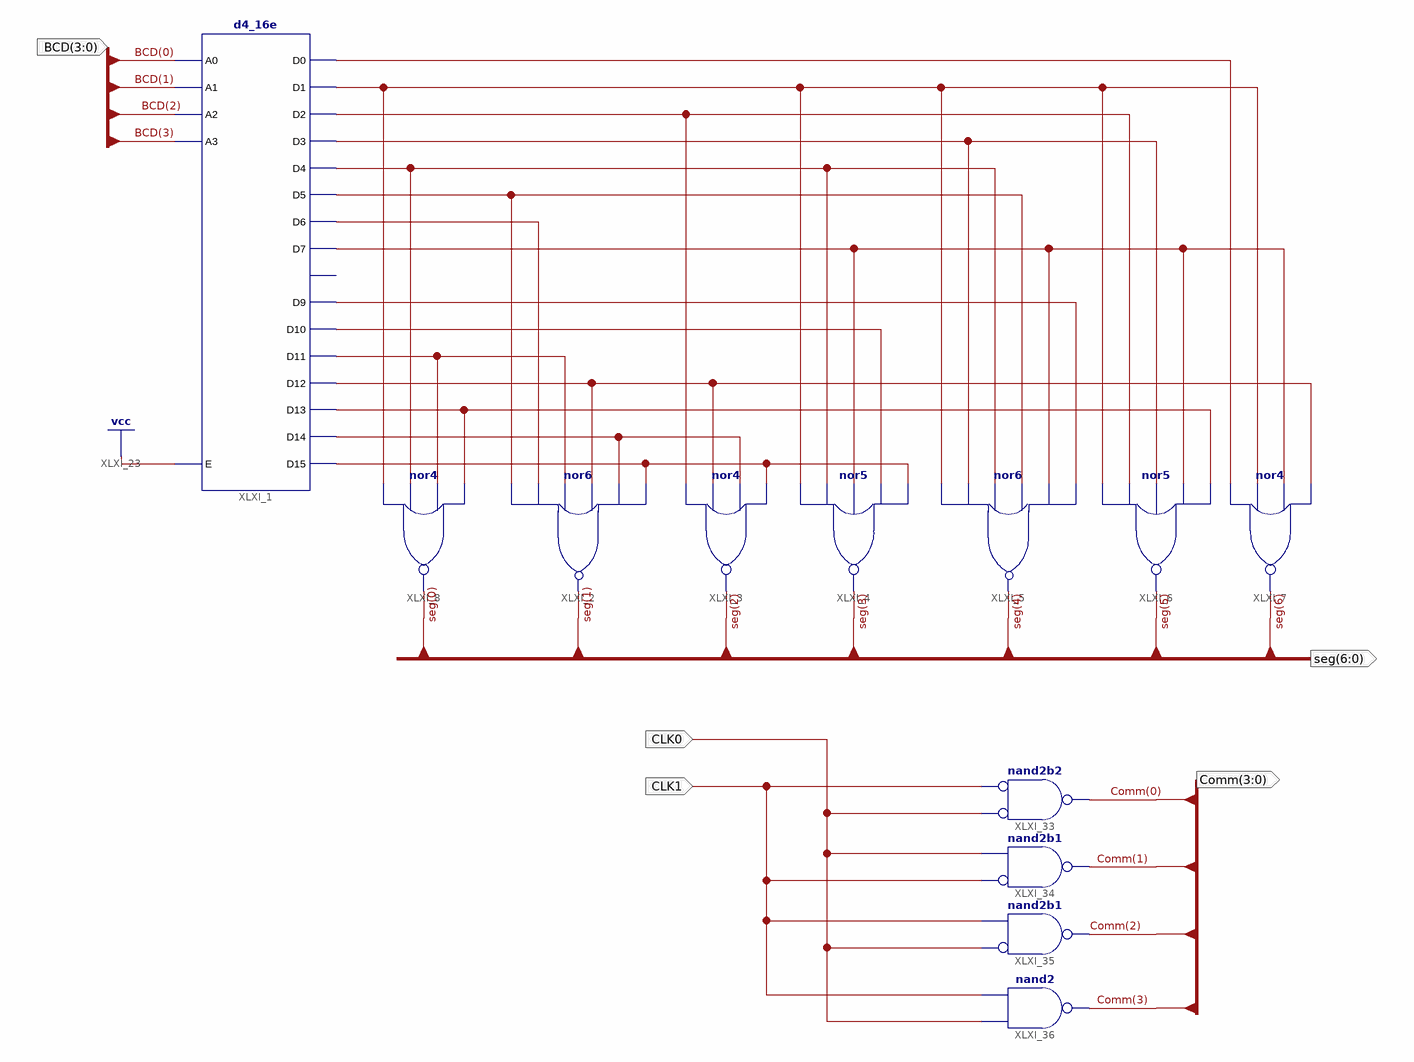
[diagram p0: schematic sheet 1]
// Xilinx ISE schematic Hexto7seg.sch (spartan6) as structural Verilog: 12 symbols, 5 ports
module Hexto7seg (
  input  [3:0] BCD,
  input  CLK1,
  input  CLK0,
  output [6:0] seg,
  output [3:0] Comm
);

  wire XLXN_1, XLXN_2, XLXN_3, XLXN_4, XLXN_5, XLXN_6, XLXN_7, XLXN_8, XLXN_9, XLXN_11, XLXN_12, XLXN_13,
       XLXN_15, XLXN_17, XLXN_18;

  d4_16e XLXI_1 (
    .A0(BCD[0]), .A1(BCD[1]), .A2(BCD[2]), .A3(BCD[3]), .E(1'b1), .D0(XLXN_15), .D1(XLXN_1), .D10(XLXN_18),
    .D11(XLXN_3), .D12(XLXN_7), .D13(XLXN_4), .D14(XLXN_8), .D15(XLXN_9), .D2(XLXN_11), .D3(XLXN_12),
    .D4(XLXN_2), .D5(XLXN_5), .D6(XLXN_6), .D7(XLXN_17), .D9(XLXN_13));  // open: D8
  nor XLXI_2 (seg[1], XLXN_5, XLXN_6, XLXN_3, XLXN_7, XLXN_8, XLXN_9);
  nor XLXI_3 (seg[2], XLXN_11, XLXN_7, XLXN_8, XLXN_9);
  nor XLXI_4 (seg[3], XLXN_1, XLXN_2, XLXN_17, XLXN_18, XLXN_9);
  nor XLXI_5 (seg[4], XLXN_1, XLXN_12, XLXN_2, XLXN_5, XLXN_17, XLXN_13);
  nor XLXI_6 (seg[5], XLXN_1, XLXN_11, XLXN_12, XLXN_17, XLXN_4);
  nor XLXI_7 (seg[6], XLXN_15, XLXN_1, XLXN_17, XLXN_7);
  nor XLXI_8 (seg[0], XLXN_1, XLXN_2, XLXN_3, XLXN_4);
  nand XLXI_35 (Comm[2], ~CLK0, CLK1);  // nand2b1
  nand XLXI_36 (Comm[3], CLK0, CLK1);
  nand XLXI_34 (Comm[1], ~CLK1, CLK0);  // nand2b1
  nand XLXI_33 (Comm[0], ~CLK0, ~CLK1);  // nand2b2
endmodule
